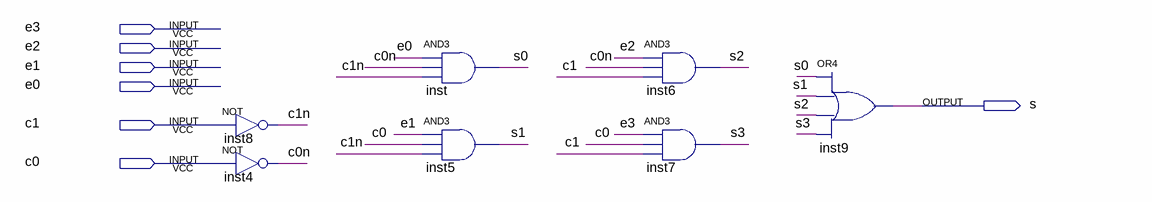
[diagram p0: schematic sheet]
// Quartus schematic ldm_mux_4x1_1bit.bdf as structural Verilog: 7 symbols, 7 pins
module ldm_mux_4x1_1bit (
  input  e3,
  input  e2,
  input  e1,
  input  e0,
  input  c1,
  input  c0,
  output s
);

  wire c0n, c1n, s0, s1, s2, s3;

  not inst8 (c1n, c1);
  not inst4 (c0n, c0);
  and inst (s0, e0, c0n, c1n);
  and inst5 (s1, e1, c0, c1n);
  and inst6 (s2, e2, c0n, c1);
  and inst7 (s3, e3, c0, c1);
  or inst9 (s, s0, s1, s2, s3);
endmodule
